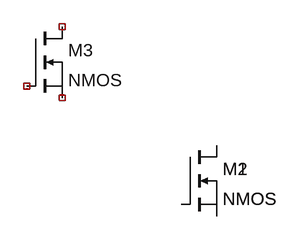
[diagram p0: schematic Draft5.asc]
Draft5.asc, the LTspice schematic file:
Version 4
SHEET 1 880 680
SYMBOL nmos 240 208 R0
SYMATTR InstName M1
SYMBOL nmos 240 208 R0
SYMATTR InstName M2
SYMBOL nmos 32 48 R0
SYMATTR InstName M3

The netlist it stands for:
* Draft5.asc
M1 P001 P002 P003 P003 NMOS
M2 P001 P002 P003 P003 NMOS
M3 NC_01 NC_02 NC_03 NC_03 NMOS
.model NMOS NMOS
.model PMOS PMOS
.lib standard.mos
.backanno
.end